# EAGLE design CanSatSecundaria (EAGLE 9.5.2)
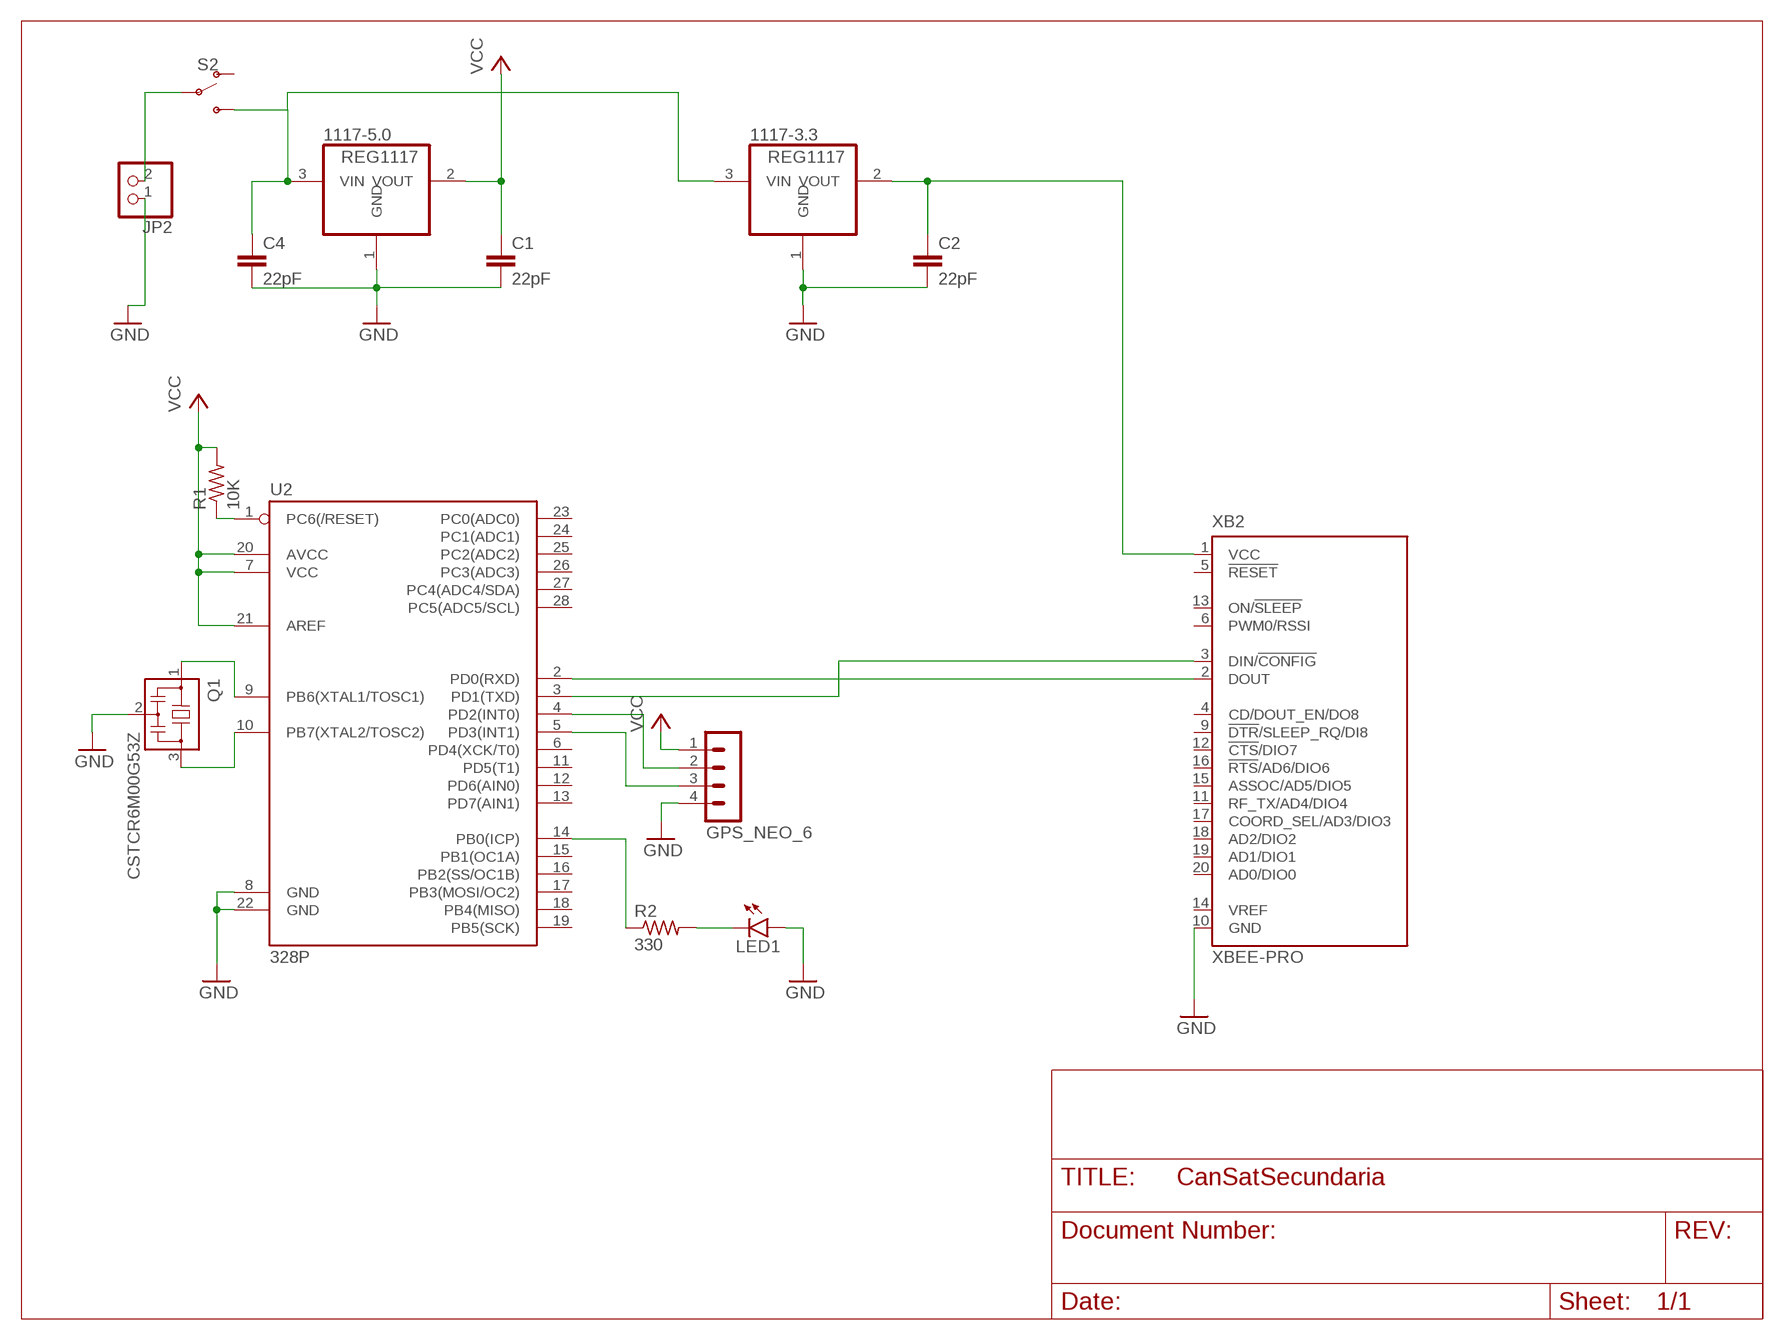
[diagram p0: schematic, sheet 1]

## Parts
1117-3.3  REG1117  [SOT223]
1117-5.0  REG1117  [SOT223]
C1  22pF  C-EUC1206  [C1206]
C2  22pF  C-EUC1206  [C1206]
C4  22pF  C-EUC1206  [C1206]
GPS_NEO_6  MA04-1  [MA04-1]
JP2  PINHD-1X2/90  [1X02/90]
LED1  LEDSMT1206  [1206]
Q1  CSTCR6M00G53Z  [CSTCR6M]
R1  10K  R-US_M1206  [M1206]
R2  330  R-US_R1206  [R1206]
S2  SWITCH-SPDT-SMD-RIGHT-ANGLE  [SWITCH_SPST_SMD_A]
U2  328P  ATMEGA328P_PDIP  [DIP28]
XB2  XBEE-PRO  [XBEE-PRO]

## Nets
GND: 1117-3.3.1(GND) 1117-5.0.1(GND) C1.2 C2.2 C4.2 GPS_NEO_6.4 JP2.1 LED1.A Q1.2 U2.8(GND) U2.22(GND) XB2.10(GND)
N$1: 1117-3.3.2(VOUT) C2.1 XB2.1(VCC)
N$2: Q1.1 U2.9(PB6(XTAL1/TOSC1))
N$3: U2.2(PD0(RXD)) XB2.2(DOUT)
N$4: Q1.3 U2.10(PB7(XTAL2/TOSC2))
N$5: R1.1 U2.1(PC6(/RESET))
N$6: GPS_NEO_6.2 U2.4(PD2(INT0))
N$7: U2.3(PD1(TXD)) XB2.3(DIN/!CONFIG)
N$8: 1117-3.3.3(VIN) 1117-5.0.3(VIN) C4.1 S2.3(S)
N$9: JP2.2 S2.2(P)
N$10: GPS_NEO_6.3 U2.5(PD3(INT1))
N$11: R2.1 U2.14(PB0(ICP))
N$12: LED1.C R2.2
VCC: 1117-5.0.2(VOUT) C1.1 GPS_NEO_6.1 R1.2 U2.7(VCC) U2.20(AVCC) U2.21(AREF)
Unconnected: S2.1(O) U2.6(PD4(XCK/T0)) U2.11(PD5(T1)) U2.12(PD6(AIN0)) U2.13(PD7(AIN1)) U2.15(PB1(OC1A)) U2.16(PB2(SS/OC1B)) U2.17(PB3(MOSI/OC2)) U2.18(PB4(MISO)) U2.19(PB5(SCK)) U2.23(PC0(ADC0)) U2.24(PC1(ADC1)) U2.25(PC2(ADC2)) U2.26(PC3(ADC3)) U2.27(PC4(ADC4/SDA)) U2.28(PC5(ADC5/SCL)) XB2.4(CD/DOUT_EN/DO8) XB2.5(!RESET) XB2.6(PWM0/RSSI) XB2.9(!DTR!/SLEEP_RQ/DI8) XB2.11(RF_TX/AD4/DIO4) XB2.12(!CTS!/DIO7) XB2.13(ON/!SLEEP) XB2.14(VREF) XB2.15(ASSOC/AD5/DIO5) XB2.16(!RTS!/AD6/DIO6) XB2.17(COORD_SEL/AD3/DIO3) XB2.18(AD2/DIO2) XB2.19(AD1/DIO1) XB2.20(AD0/DIO0)

## Library data of the parts
1117-3.3 1117-5.0 = burr-brown:REG1117: 800mA and 1A Low Dropout (LDO) Positive Regulator 1.8V, 2.5V, 2.85V, 3.3V, 5V, and Adj; MPN: REG1117; OC_FARNELL: 1097566; OC_NEWARK: 14P6981
C1 C2 C4 = rcl:C-EU: CAPACITOR, European symbol; SPICEPREFIX: C
GPS_NEO_6 = con-lstb:MA04-1: PIN HEADER; OC_FARNELL: unknown; OC_NEWARK: unknown
JP2 = pinhead:PINHD-1X2: PIN HEADER
LED1 = led:LED: LED OSRAM: - CHIPLED LG R971, LG N971, LY N971, LG Q971, LY Q971, LO R971, LY R971 LH N974, LH R974 LS Q976, LO Q976, LY Q976 LO Q996 - Hyper CHIPLED LW Q18S LB Q993, LB Q99A, LB R99A - SideLED LS A670, LO A670, LY A670, LG A670, LP A670 LB A673, LV A673, LT A673, LW A673 LH A674 LY A675 LS A676, LA A676, LO A676, LY A676, LW A676 LS A679, LY A679, LG A679 - Hyper Micro SIDELED® LS Y876, LA Y876, LO Y876, LY Y876 LT Y87S - SmartLED LW L88C, LW L88S LB L89C, LB L89S, LG L890 LS L89K, LO L89K, LY L89K LS L896, LA L896, LO L896, LY L896 - TOPLED LS T670, LO T670, LY T670, LG T670, LP T670 LSG T670, LSP T670, LSY T670, LOP T670, LYG T670 LG T671, LOG T671, LSG T671 LB T673, LV T673, LT T673, LW T673 LH T674 LS T676, LA T676, LO T676, LY T676, LB T676, LH T676, LSB T676, LW T676 LB T67C, LV T67C, LT T67C, LS T67K, LO T67K, LY T67K, LW E67C LS E67B, LA E67B, LO E67B, LY E67B, LB E67C, LV E67C, LT E67C LW T67C LS T679, LY T679, LG T679 LS T770, LO T770, LY T770, LG T770, LP T770 LB T773, LV T773, LT T773, LW T773 LH T774 LS E675, LA E675, LY E675, LS T675 LS T776, LA T776, LO T776, LY T776, LB T776 LHGB T686 LT T68C, LB T68C - Hyper Mini TOPLED® LB M676 - Mini TOPLED Santana® LG M470 LS M47K, LO M47K, LY M47K Source: http://www.osram.convergy.de LUXEON: - LUMILED® LXK2-PW12-R00, LXK2-PW12-S00, LXK2-PW14-U00, LXK2-PW14-V00 LXK2-PM12-R00, LXK2-PM12-S00, LXK2-PM14-U00 LXK2-PE12-Q00, LXK2-PE12-R00, LXK2-PE12-S00, LXK2-PE14-T00, LXK2-PE14-U00 LXK2-PB12-K00, LXK2-PB12-L00, LXK2-PB12-M00, LXK2-PB14-N00, LXK2-PB14-P00, LXK2-PB14-Q00 LXK2-PR12-L00, LXK2-PR12-M00, LXK2-PR14-Q00, LXK2-PR14-R00 LXK2-PD12-Q00, LXK2-PD12-R00, LXK2-PD12-S00 LXK2-PH12-R00, LXK2-PH12-S00 LXK2-PL12-P00, LXK2-PL12-Q00, LXK2-PL12-R00 Source: www.luxeon.com KINGBRIGHT: KA-3528ASYC Source: www.kingbright.com
Q1 = murata-filter:CSTCR: Resonator Source: murata.co.jp; MPN: CSTCR6M00G53-R0; OC_FARNELL: 1170434; OC_NEWARK: 25M8759
R1 R2 = adafruit:R-US_: RESISTOR, American symbol
S2 = SparkFun-Switches:SWITCH-SPDT: Single Pole, Double Throw (SPDT) Switch Single-pole, double-throw (SPDT) switch. Variant Overview SMD-AYZ0202 Surface Mount DPDT Switch <https://www.sparkfun.com/products/597> (COM-00597) Used on e.g. LilyPad Arduino USB - ATmega32U4 Board <https://www.sparkfun.com/products/12049> PTH-11.6X4.0MM SPDT Mini Power Switch <https://www.sparkfun.com/products/102> (COM-00102) Used on e.g. SparkFun Simon Says - Through-Hole Soldering Kit <https://www.sparkfun.com/products/10547> (KIT-10547) PTH-11.6X4.0MM-KIT KIT version of SPDT Mini Power Switch - Simplifies soldering by removing tStop of switch pins - only one side can be soldered. PTH-11.6X4.0MM-LOCK LOCK version of SPDT Mini Power Switch - Offset pins hold switch in place for easier soldering. SMD-RIGHT-ANGLE Surface Mount Right Angle Switch <https://www.sparkfun.com/products/10860> (COM-10860) Used on e.g. SparkFun ESP8266 Thing <https://www.sparkfun.com/products/13231>; PROD_ID: SWCH-10651; SF_SKU: COM-10860
U2 = SparkFun-IC-Microcontroller:ATMEGA328P_PDIP: Atmel 328P Through hole ATMEGA328P uC used in the Arduino 32kb flash, 1k EEPROM, 2k SRAM Datasheet <http://www.sparkfun.com/datasheets/Components/SMD/ATMega328.pdf> SparkFun Products Storefront component: AVR 28 Pin 20MHz 32K 6A/D - ATMega328P <https://www.sparkfun.com/products/9061> (COM-09061) SparkFun Simon Says - Through-Hole Soldering Kit <https://www.sparkfun.com/products/10547> (KIT-10547) SparkFun Learn to Solder - Simon Says <https://www.sparkfun.com/products/13708> (KIT-13708) SparkFun BigTime Watch Kit <https://www.sparkfun.com/products/11734> (KIT-11734) SparkFun ClockIt <https://www.sparkfun.com/products/10930> (KIT-10930) SparkFun Serial Enabled LCD Kit <https://www.sparkfun.com/products/10097> (LCD-10097) SparkFun Simon Tilts - Through Hole Soldering Kit <https://www.sparkfun.com/products/12634> (KIT-12634) SparkFun Frequency Counter Kit <https://www.sparkfun.com/products/10140> (KIT-10140) FabFM Radio Kit <https://www.sparkfun.com/products/11043> (KIT-11043) SparkFun Binary Blaster Kit <https://www.sparkfun.com/products/12037> (KIT-12037) SparkFun Metro-Gnome <https://www.sparkfun.com/products/9236> (KIT-09236) ATmega328 with Arduino Optiboot (Uno) <https://www.sparkfun.com/products/10524> (DEV-10524); PROD_ID: IC-09136
XB2 = maxstream:XBEE: XBee (TM) /XBee-PRO(TM) OEM RF Modules Source: MaxStream, Inc. xbee_productmanual.pdf; MPN: XBP24-AWI-001; OC_FARNELL: 1337916; OC_NEWARK: 42M2667

## Board
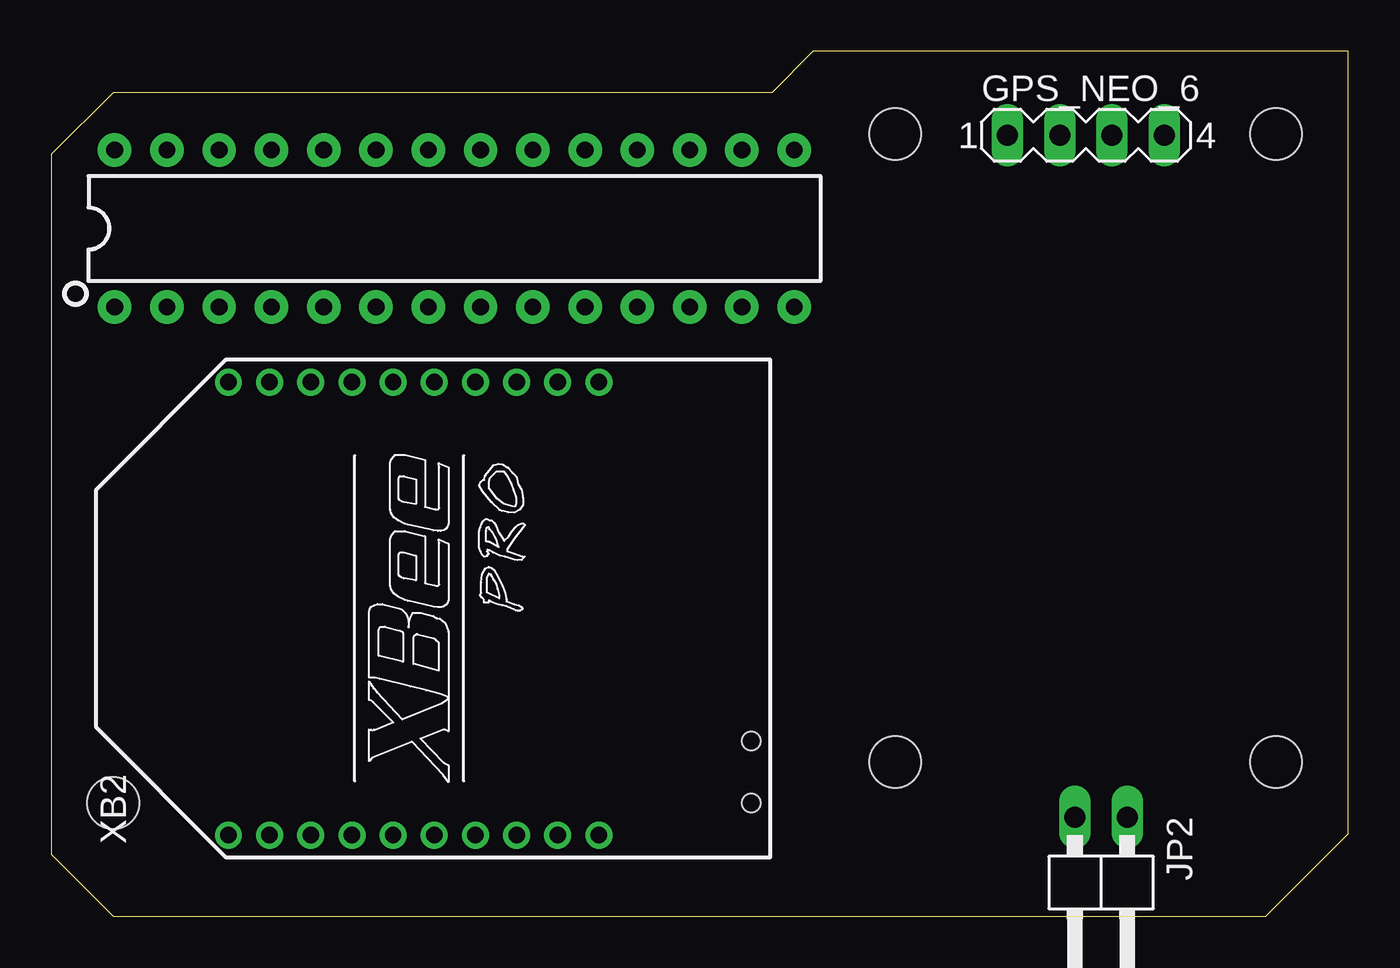
[diagram p1: board, top side]
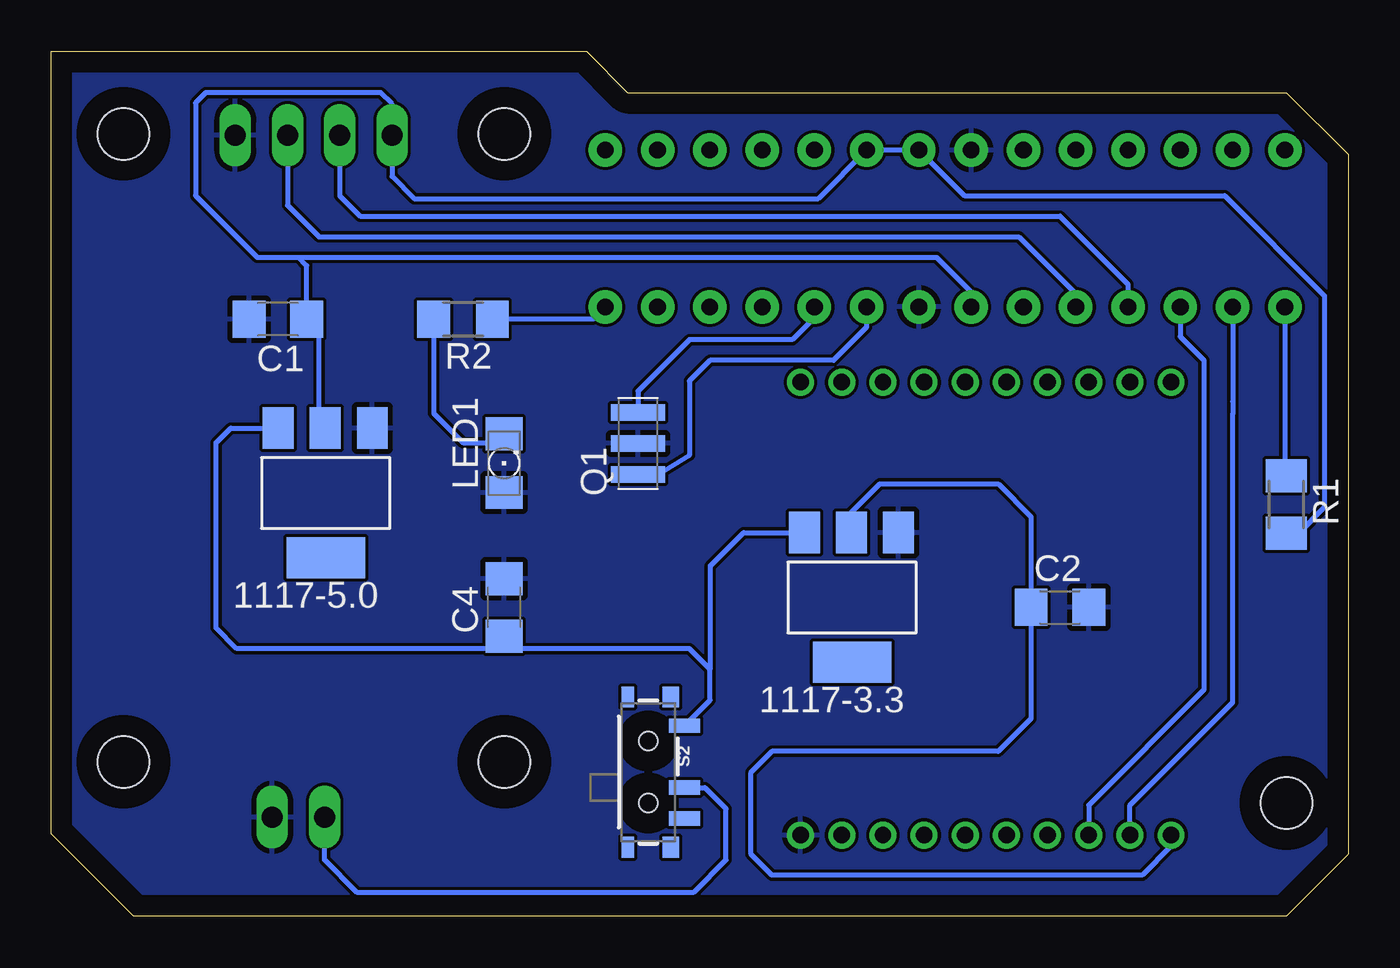
[diagram p2: board, bottom side, seen from below]

Size 63 x 42 mm. Coordinates in mm from the lower left corner, seen from the top.
Outline: 0,3 3,0 59,0 63,4 63,42 37,42 35,40 3,40 0,37 0,3
Copper layers (1*16): Top 0.035mm / dielectric 1.5mm / Bottom 0.035mm
Design rules "default": minimum track width 6mil, minimum drill 0.35mm, track to track 6mil, track to pad 6mil, pad to pad 6mil, via to via 6mil, smd to smd 6mil, copper to edge 40mil, drill to drill 6mil, minimum pad ring 10mil, minimum via ring 8mil, stop-mask expansion 4mil, vias tented up to drill 0mil, thermal gap 10mil
Holes 2.5 mm at 59.5,7.5 59.5,38 41,7.5 3,5.5 41,38

### Footprints (pad centres in the part's own frame; a part is rotated, then mirrored left to right if it is on the bottom)
SOT223 = smd 1.499 x 2.007: 1 -2.261,-3.15; 2 0.025,-3.15; 3 2.311,-3.15 | smd 3.81 x 2.007: 4 0,3.15
C1206 = smd 1.6 x 1.8: 1 -1.4,0; 2 1.4,0
MA04-1 = drill 1.016 long: 1 -3.81,0; 2 -1.27,0; 3 1.27,0; 4 3.81,0
1X02/90 = drill 1.016 long: 1 -1.27,-3.81; 2 1.27,-3.81
1206 = smd 1.6 x 1.803: A -1.422,0; C 1.422,0
CSTCR6M = smd 0.8 x 2.6: 1 -1.5,0; 2 0,0; 3 1.5,0
M1206 = smd 1.6 x 2: 1 -1.4,0; 2 1.4,0
R1206 = smd 1.6 x 1.803: 1 -1.422,0; 2 1.422,0
SWITCH_SPST_SMD_A = smd 0.7 x 1.5: 1 -2.25,-1.75; 2 -0.75,-1.75; 3 2.25,-1.75 | smd 1 x 0.6: GND1 -3.65,1; GND3 3.65,1 | smd 1 x 0.8: GND2 -3.65,-1.1; GND4 3.65,-1.1 | hole 0.9: -1.5,0; 1.5,0
DIP28 = drill 0.813 pad 1.626: 1 -16.51,-3.81; 2 -13.97,-3.81; 3 -11.43,-3.81; 4 -8.89,-3.81; 5 -6.35,-3.81; 6 -3.81,-3.81; 7 -1.27,-3.81; 8 1.27,-3.81; 9 3.81,-3.81; 10 6.35,-3.81; 11 8.89,-3.81; 12 11.43,-3.81; 13 13.97,-3.81; 14 16.51,-3.81; 15 16.51,3.81; 16 13.97,3.81; 17 11.43,3.81; 18 8.89,3.81; 19 6.35,3.81; 20 3.81,3.81; 21 1.27,3.81; 22 -1.27,3.81; 23 -3.81,3.81; 24 -6.35,3.81; 25 -8.89,3.81; 26 -11.43,3.81; 27 -13.97,3.81; 28 -16.51,3.81
XBEE-PRO = drill 0.8 pad 1.27: 1 -11,9; 2 -11,7; 3 -11,5; 4 -11,3; 5 -11,1; 6 -11,-1; 7 -11,-3; 8 -11,-5; 9 -11,-7; 10 -11,-9; 11 11,-9; 12 11,-7; 13 11,-5; 14 11,-3; 15 11,-1; 16 11,1; 17 11,3; 18 11,5; 19 11,7; 20 11,9

### Placement (x,y rotation side)
1117-3.3  24.1,15.48 180 bottom
1117-5.0  49.67,20.56 180 bottom
C1  52,29 180 bottom
C2  14,15 0 bottom
C4  41,15 90 bottom
GPS_NEO_6  50.26,37.93 0 top
JP2  51,1 180 top
LED1  41,22 90 bottom
Q1  34.5,22.96 90 bottom
R1  3,20 270 bottom
R2  43,29 180 bottom
S2  34,7 90 bottom
U2  19.58,33.4 0 top
XB2  17.6,14.94 90 top

### Tracks (layer width: path | path; a pad name or v marks a point on that pad's centre or on a via)
GND
  pour Bottom: 0,37 0,3 3,0 59,0 63,4 63,42 37,42 35,40 3,40
N$1
  Bottom 0.254: 1117-3.3.2 24.12,19.63 22.75,21 17,21 15.4,19.4 C2.1 15.4,9.6 17,8 28,8 29,7 29,3 28,2 10,2 8.6,3.4 XB2.1
N$2
  Bottom 0.254: U2.9 23.39,28.61 25,27 31,27 32,26 32,22.38 33.5,21.46 Q1.1
N$3
  Bottom 0.254: U2.2 5.61,25 5.61,24.39 5.61,10.39 10.6,5.4 XB2.2
N$4
  Bottom 0.254: U2.10 26,29.52 26,29 27,28 32,28 34.5,25.5 Q1.3
N$5
  Bottom 0.254: U2.1 3.07,21.47 R1.1
N$6
  Bottom 0.254: GPS_NEO_6.2 48.99,34.99 48,34 14,34 10.69,30.69 U2.4
N$7
  Bottom 0.254: U2.3 8.15,28.15 7,27 7,11 12.6,5.4 XB2.3
N$8
  Bottom 0.254: 1117-5.0.3 54.29,23.71 55,23 55,14 54,13 41.6,13 C4.1 40.4,13 32,13 31,12 | 1117-3.3.3 29.37,18.63 31,17 31,12 | S2.3 31,10.5 31,12
N$9
  Bottom 0.254: S2.2 31.26,6.25 30.22,5.22 30.22,2.73 31.81,1.14 48.14,1.14 49.73,2.73 JP2.2
N$10
  Bottom 0.254: GPS_NEO_6.3 51.53,34.53 50,33 16,33 13.23,30.23 U2.5
N$11
  Bottom 0.254: U2.14 36.68,29 R2.1
N$12
  Bottom 0.254: R2.2 44.42,24.42 43,23 41.42,23 LED1.C
VCC
  Bottom 0.254: U2.7 18.31,30.31 20,32 51,32 | 51,32 53,32 56,35 56,39.5 55.5,40 47,40 46.45,39.45 GPS_NEO_6.1 46.45,35.93 45.38,34.86 25.74,34.86 U2.20 U2.21 18.64,35 6,35 1.14,30.14 1.14,19.86 2.4,18.6 R1.2 | 1117-5.0.2 50,24.01 50,28.4 C1.1 50.6,31.6 51,32